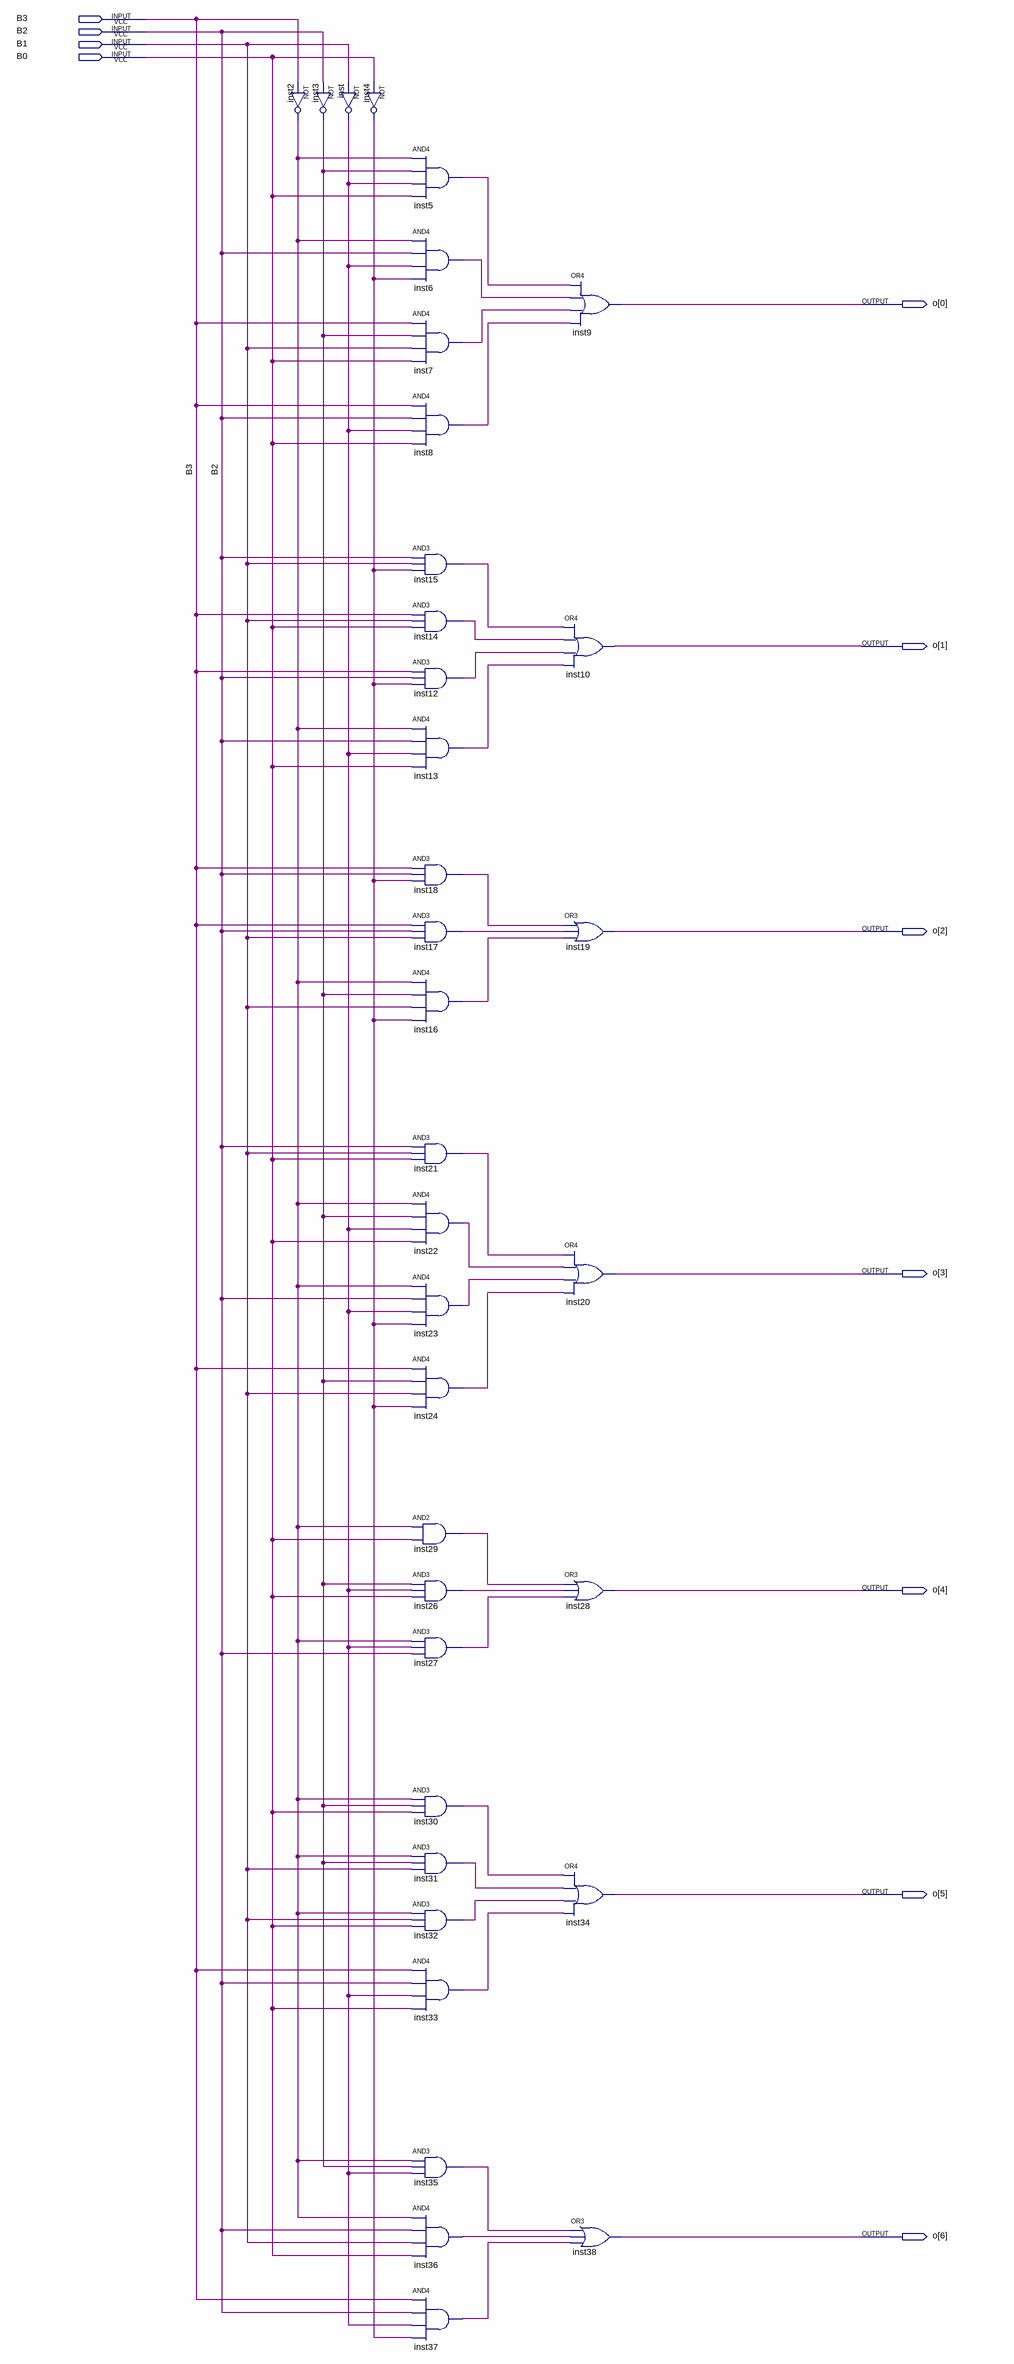
[diagram p0: schematic sheet]
// Quartus schematic Hex.bdf as structural Verilog: 36 symbols, 11 pins
module Hex (
  input  B3,
  input  B2,
  input  B1,
  input  B0,
  output [6:0] o
);

  wire inst2_out, inst3_out, inst4_out, inst5_out, inst6_out, inst7_out, inst8_out, inst12_out, inst13_out,
       inst14_out, inst15_out, inst16_out, inst17_out, inst18_out, inst21_out, inst22_out, inst23_out,
       inst24_out, inst26_out, inst27_out, inst29_out, inst30_out, inst31_out, inst32_out, inst33_out,
       inst35_out, inst36_out, inst37_out, inst_out;

  not inst2 (inst2_out, B3);
  not inst3 (inst3_out, B2);
  not inst (inst_out, B1);
  not inst4 (inst4_out, B0);
  and inst5 (inst5_out, inst2_out, inst3_out, inst_out, B0);
  and inst6 (inst6_out, inst2_out, B2, inst_out, inst4_out);
  and inst7 (inst7_out, B3, inst3_out, B1, B0);
  and inst8 (inst8_out, B3, B2, inst_out, B0);
  and inst15 (inst15_out, B2, B1, inst4_out);
  and inst14 (inst14_out, B3, B1, B0);
  and inst12 (inst12_out, B3, B2, inst4_out);
  and inst13 (inst13_out, inst2_out, B2, inst_out, B0);
  and inst18 (inst18_out, B3, B2, inst4_out);
  and inst17 (inst17_out, B3, B2, B1);
  and inst16 (inst16_out, inst2_out, inst3_out, B1, inst4_out);
  and inst21 (inst21_out, B2, B1, B0);
  and inst22 (inst22_out, inst2_out, inst3_out, inst_out, B0);
  and inst23 (inst23_out, inst2_out, B2, inst_out, inst4_out);
  and inst24 (inst24_out, B3, inst3_out, B1, inst4_out);
  and inst29 (inst29_out, inst2_out, B0);
  and inst26 (inst26_out, inst3_out, inst_out, B0);
  and inst27 (inst27_out, inst2_out, inst_out, B2);
  and inst30 (inst30_out, inst2_out, inst3_out, B0);
  and inst31 (inst31_out, inst2_out, inst3_out, B1);
  and inst32 (inst32_out, inst2_out, B1, B0);
  and inst33 (inst33_out, B3, B2, inst_out, B0);
  and inst35 (inst35_out, inst2_out, inst3_out, inst_out);
  and inst36 (inst36_out, inst2_out, B2, B1, B0);
  and inst37 (inst37_out, B3, B2, inst_out, inst4_out);
  or inst9 (o[0], inst5_out, inst6_out, inst7_out, inst8_out);
  or inst10 (o[1], inst15_out, inst14_out, inst12_out, inst13_out);
  or inst19 (o[2], inst18_out, inst17_out, inst16_out);
  or inst20 (o[3], inst21_out, inst22_out, inst23_out, inst24_out);
  or inst28 (o[4], inst29_out, inst26_out, inst27_out);
  or inst34 (o[5], inst30_out, inst31_out, inst32_out, inst33_out);
  or inst38 (o[6], inst35_out, inst36_out, inst37_out);
endmodule
